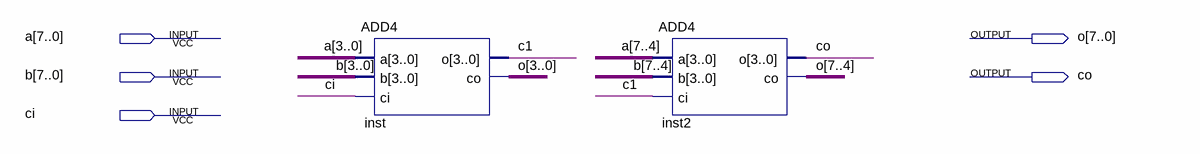
[diagram p0: schematic sheet]
// Quartus schematic ADD8.bdf as structural Verilog: 2 symbols, 5 pins
module ADD8 (
  input  [7:0] a,
  input  [7:0] b,
  input  ci,
  output [7:0] o,
  output co
);

  wire c1;

  ADD4 inst (.a(a[3:0]), .b(b[3:0]), .ci(ci), .o(c1), .co(o[3:0]));
  ADD4 inst2 (.a(a[7:4]), .b(b[7:4]), .ci(c1), .o(co), .co(o[7:4]));
endmodule
